# EAGLE schematic stm32_mather (EAGLE 9.6.2)
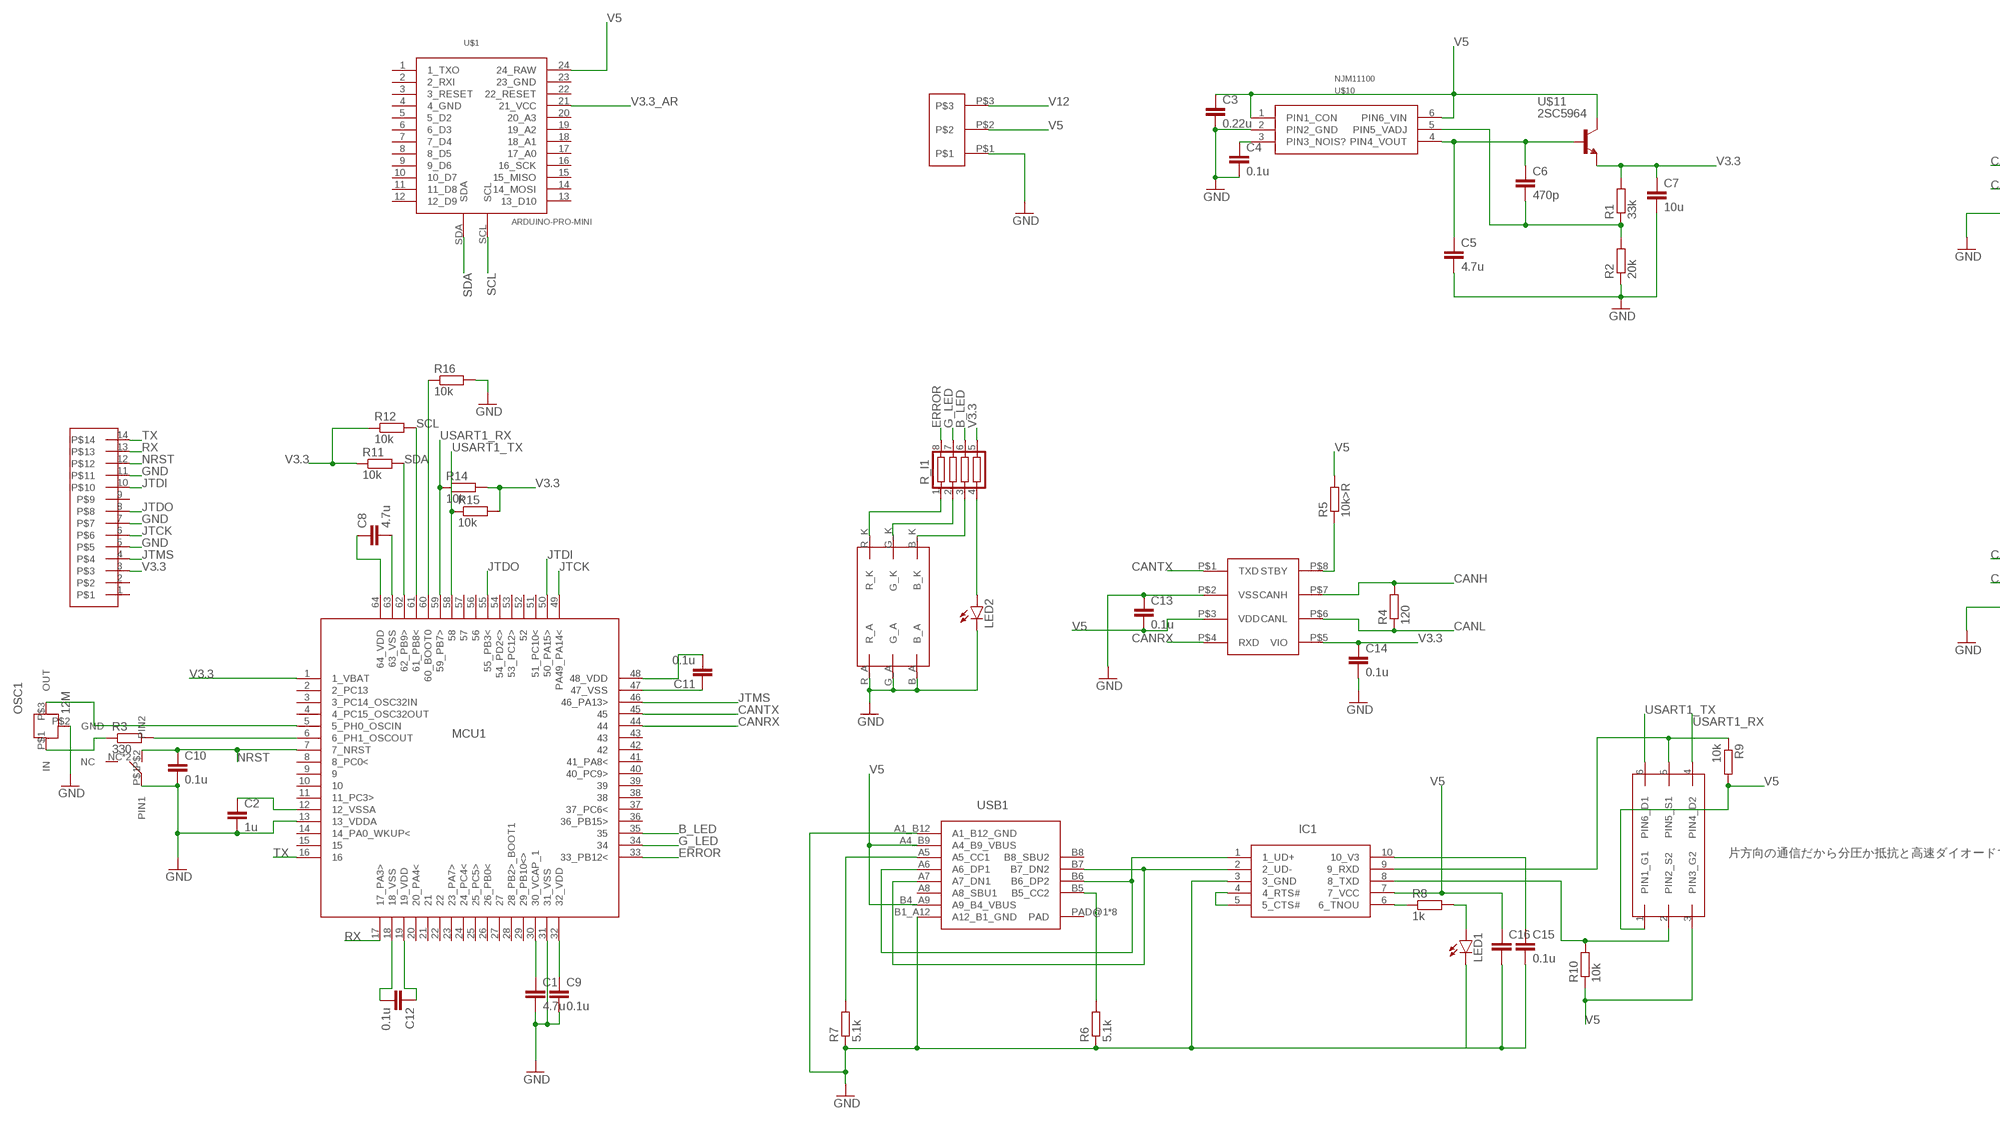
[diagram p0: schematic, sheet 1, part 1 of 2]
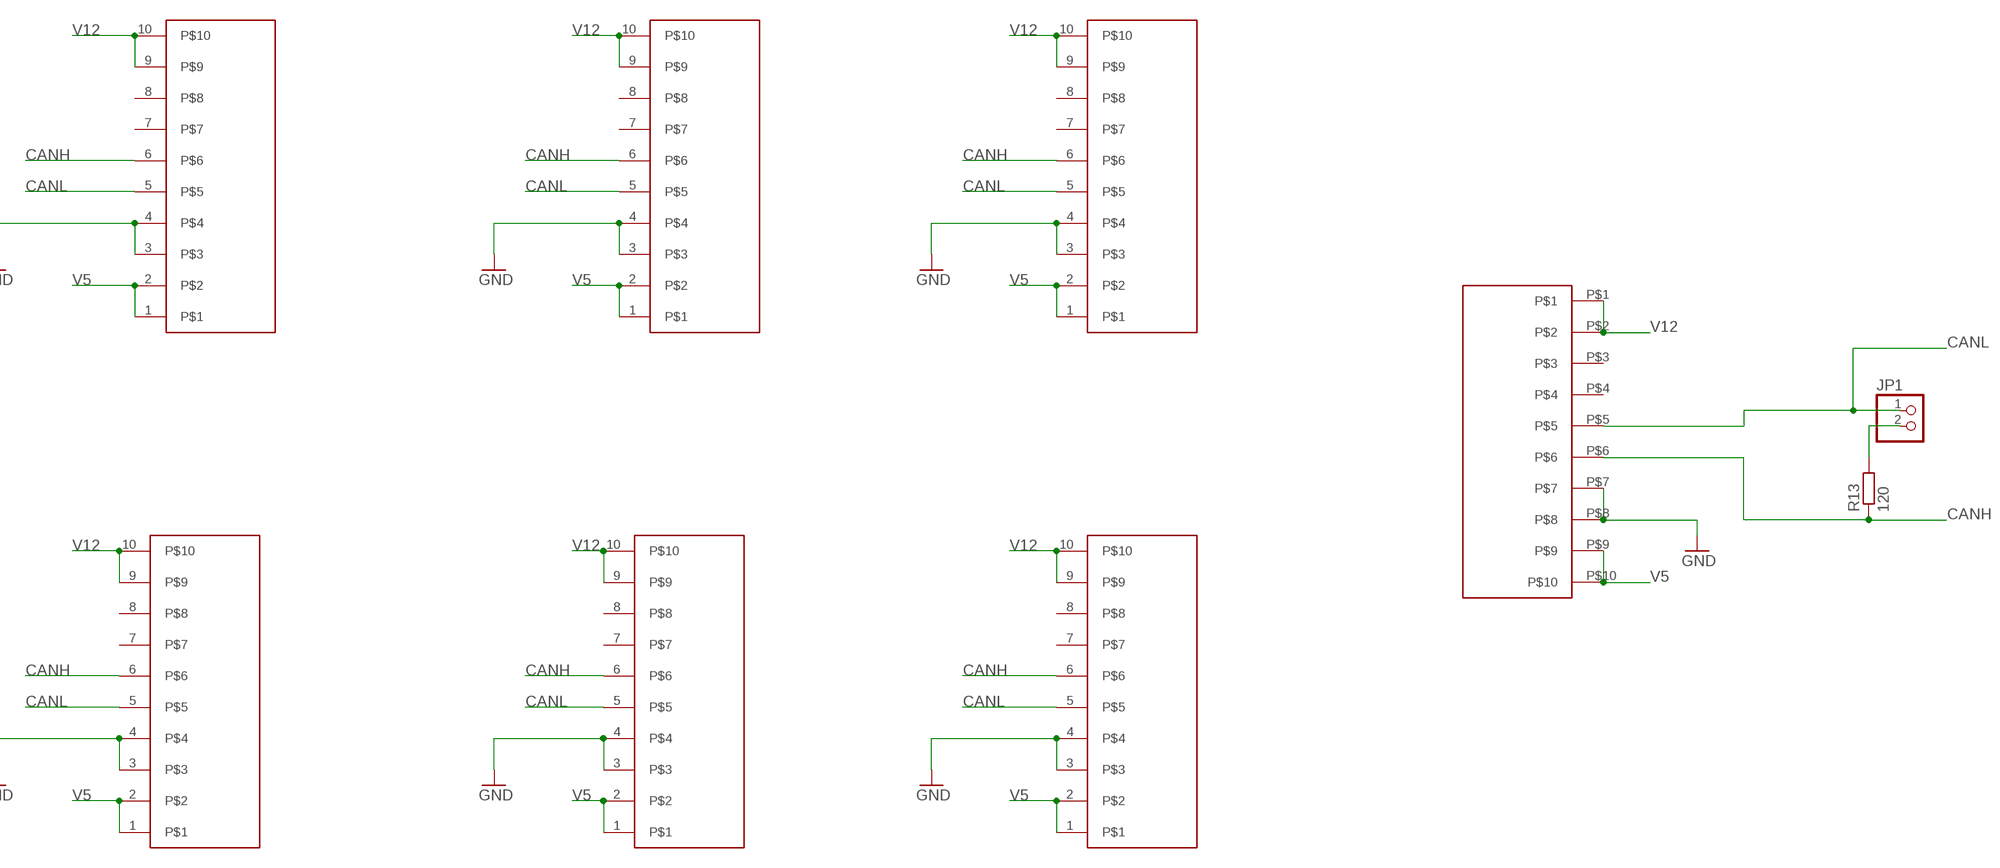
[diagram p1: schematic, sheet 1, part 2 of 2]

## Parts
C1  4.7u  C-EUC1608  [C1608]
C2  1u  C-EUC1608  [C1608]
C3  0.22u  C-EUC2012  [C2012]
C4  0.1u  C-EUC1608  [C1608]
C5  4.7u  C-EUC2012  [C2012]
C6  470p  C-EUC1608  [C1608]
C7  10u  C-EUC2012  [C2012]
C8  4.7u  C-EUC1608  [C1608]
C9  0.1u  C-EUC1608  [C1608]
C10  0.1u  C-EUC1608  [C1608]
C11  0.1u  C-EUC1608  [C1608]
C12  0.1u  C-EUC1608  [C1608]
C13  0.1u  C-EUC1608  [C1608]
C14  0.1u  C-EUC1608  [C1608]
C15  0.1u  C-EUC1608  [C1608]
C16  C-EUC1608  [C1608]
IC1  CH340E  [MSOP10]
JP1  PINHD-1X2  [1X02]
LED1  1608LED  [1608]
LED2  1608LED  [1608]
MCU1  STM32F446  [LQFP64-2]
OSC1  12M  CSTN#  [CSTNE#]
R1  33k  R_REG  [1608]
R2  20k  R_REG  [1608]
R3  330  R_REG  [1608]
R4  120  R_REG  [1608]
R5  10k>R  R_REG  [1608]
R6  5.1k  R_REG  [1608]
R7  5.1k  R_REG  [1608]
R8  1k  R_REG  [1608]
R9  10k  R_REG  [1608]
R10  10k  R_REG  [1608]
R11  10k  R_REG  [1608]
R12  10k  R_REG  [1608]
R13  120  R_REG  [1608]
R14  10k  R_REG  [1608]
R15  10k  R_REG  [1608]
R16  10k  R_REG  [1608]
R_I1  R_SHUGOU  [0603X4RESISTOR]
U$1  ARDUINO-PRO-MINI  [ARDUINO_PRO_MINI]
U$2  BOX10PBOX10PIN-MESU  [BOX10P-MESU]
U$3  BOX10PBOX10PIN-MESU  [BOX10P-MESU]
U$4  BOX10PBOX10PIN-MESU  [BOX10P-MESU]
U$5  BOX10PBOX10PIN-MESU  [BOX10P-MESU]
U$6  BOX10PBOX10PIN-MESU  [BOX10P-MESU]
U$7  BOX10PBOX10PIN-MESU  [BOX10P-MESU]
U$8  BOX10PBOX10P-L  [BOX10P-L]
U$9  YUROBLOCK3  [YUROBLOCK3]
U$10  NJM11100  [SOT23-6]
U$11  2SC5964  [PCP]
U$12  TAKUTOSUITTI2  [TAKUTOSUITTI2]
U$13  MCP2562MCP2561-SN  [SOIC8]
U$14  FDC6305  [SSOT6]
U$15  RGB_LED  [RGB_LED]
U$22  BOX14P  [CON_HEDA14P_1.27]
USB1  USB_TYPE_C  [USB_TYPE_C]

## Nets
B_LED: MCU1.35 R_I1.6
CANH: R4.2 R13.1 U$2.6 U$3.6 U$4.6 U$5.6 U$6.6 U$7.6 U$8.P$6 U$13.P$7(CANH)
CANL: JP1.1 R4.1 U$2.5 U$3.5 U$4.5 U$5.5 U$6.5 U$7.5 U$8.P$5 U$13.P$6(CANL)
CANRX: MCU1.44 U$13.P$4(RXD)
CANTX: MCU1.45 U$13.P$1(TXD)
ERROR: MCU1.33(33_PB12<) R_I1.8
G_LED: MCU1.34 R_I1.7
GND: C1.2 C3.2 C4.2 C5.2 C7.2 C9.2 C13.1 C14.2 C15.2 C16.2 IC1.3(3_GND) LED1.K LED2.K MCU1.31(31_VSS) OSC1.P$2(GND) R2.1 R6.1 R7.1 R16.2 U$2.3 U$2.4 U$3.3 U$3.4 U$4.3 U$4.4 U$5.3 U$5.4 U$6.3 U$6.4 U$7.3 U$7.4 U$8.P$7 U$8.P$8 U$9.P$1 U$10.2(PIN2_GND) U$13.P$2(VSS) U$15.B_A U$15.G_A U$15.R_A U$22.5 U$22.7 U$22.11 USB1.A1_B12(A1_B12_GND) USB1.B1_A12(A12_B1_GND)
JTCK: MCU1.49(PA49_PA14<) U$22.6
JTDI: MCU1.50(50_PA15>) U$22.10
JTDO: MCU1.55(55_PB3<) U$22.8
JTMS: MCU1.46(46_PA13>) U$22.4
N$1: C6.2 R1.1 R2.2 U$10.5(PIN5_VADJ)
N$2: C4.1 U$10.3(PIN3_NOIS?)
N$3: C5.1 C6.1 U$10.4(PIN4_VOUT) U$11.1(B)
N$4: C1.1 MCU1.30(30_VCAP_1)
N$5: C9.1 MCU1.32(32_VDD)
N$6: OSC1.P$1(IN) R3.1
N$7: C2.1 MCU1.12(12_VSSA)
N$8: C8.1 MCU1.64(64_VDD)
N$9: C8.2 MCU1.63(63_VSS)
N$10: R_I1.1 U$15.R_K
N$11: MCU1.5(5_PH0_OSCIN) OSC1.P$3(OUT)
N$12: MCU1.6(6_PH1_OSCOUT) R3.2
N$13: C12.2 MCU1.18(18_VSS)
N$14: C12.1 MCU1.19(19_VDD)
N$15: C11.1 MCU1.47(47_VSS)
N$16: C11.2 MCU1.48(48_VDD)
N$17: IC1.1(1_UD+) USB1.A6(A6_DP1) USB1.B6(B6_DP2)
N$18: IC1.2(2_UD-) USB1.A7(A7_DN1) USB1.B7(B7_DN2)
N$19: R5.1 U$13.P$8(STBY)
N$20: R7.2 USB1.A5(A5_CC1)
N$21: R6.2 USB1.B5(B5_CC2)
N$22: IC1.6(6_TNOU) R8.1
N$23: LED1.A R8.2
N$24: C15.1 IC1.10(10_V3)
N$25: IC1.4(4_RTS#) IC1.5(5_CTS#)
N$26: IC1.8(8_TXD) R10.2 U$14.2(PIN2_S2)
N$27: JP1.2 R13.2
N$28: IC1.9(9_RXD) R9.1 U$14.5(PIN5_S1)
N$29: R_I1.2 U$15.G_K
N$30: C2.2 C10.2 MCU1.13(13_VDDA) U$12.P$1(PIN1) ; supply symbol labelled GND
N$31: R_I1.3 U$15.B_K
N$32: LED2.A R_I1.4
N$33: MCU1.60(60_BOOT0) R16.1
NRST: C10.1 MCU1.7(7_NRST) U$12.P$2(PIN2) U$22.12
RX: MCU1.17(17_PA3>) U$22.13
SCL: MCU1.61(61_PB8<) R12.2 U$1.SCL
SDA: MCU1.62(62_PB9>) R11.2 U$1.SDA
TX: MCU1.16 U$22.14
USART1_RX: MCU1.59(59_PB7>) R14.1 U$14.4(PIN4_D2)
USART1_TX: MCU1.58 R15.1 U$14.6(PIN6_D1)
V3.3: C7.1 C14.1 MCU1.1(1_VBAT) R1.2 R11.1 R12.1 R14.2 R15.2 R_I1.5 U$11.3(E) U$13.P$5(VIO) U$22.3
V3.3_AR: U$1.21(21_VCC)
V5: C3.1 C13.2 C16.1 IC1.7(7_VCC) R5.2 R9.2 R10.1 U$1.24(24_RAW) U$2.1 U$2.2 U$3.1 U$3.2 U$4.1 U$4.2 U$5.1 U$5.2 U$6.1 U$6.2 U$7.1 U$7.2 U$8.P$9 U$8.P$10 U$9.P$2 U$10.1(PIN1_CON) U$10.6(PIN6_VIN) U$11.2(C) U$11.2@2(C) U$13.P$3(VDD) U$14.1(PIN1_G1) U$14.3(PIN3_G2) USB1.A4_B9(A4_B9_VBUS) USB1.B4_A9(A9_B4_VBUS)
V12: U$2.9 U$2.10 U$3.9 U$3.10 U$4.9 U$4.10 U$5.9 U$5.10 U$6.9 U$6.10 U$7.9 U$7.10 U$8.P$1 U$8.P$2 U$9.P$3
Unconnected: MCU1.2(2_PC13) MCU1.3(3_PC14_OSC32IN) MCU1.4(4_PC15_OSC32OUT) MCU1.8(8_PC0<) MCU1.9 MCU1.10 MCU1.11(11_PC3>) MCU1.14(14_PA0_WKUP<) MCU1.15 MCU1.20(20_PA4<) MCU1.21 MCU1.22 MCU1.23(23_PA7>) MCU1.24(24_PC4<) MCU1.25(25_PC5>) MCU1.26(26_PB0<) MCU1.27 MCU1.28(28_PB2>_BOOT1) MCU1.29(29_PB10<>) MCU1.36(36_PB15>) MCU1.37(37_PC6<) MCU1.38 MCU1.39 MCU1.40(40_PC9>) MCU1.41(41_PA8<) MCU1.42 MCU1.43 MCU1.51(51_PC10<) MCU1.52 MCU1.53(53_PC12>) MCU1.54(54_PD2<>) MCU1.56 MCU1.57 U$1.1(1_TXO) U$1.2(2_RXI) U$1.3(3_RESET) U$1.4(4_GND) U$1.5(5_D2) U$1.6(6_D3) U$1.7(7_D4) U$1.8(8_D5) U$1.9(9_D6) U$1.10(10_D7) U$1.11(11_D8) U$1.12(12_D9) U$1.13(13_D10) U$1.14(14_MOSI) U$1.15(15_MISO) U$1.16(16_SCK) U$1.17(17_A0) U$1.18(18_A1) U$1.19(19_A2) U$1.20(20_A3) U$1.22(22_RESET) U$1.23(23_GND) U$2.7 U$2.8 U$3.7 U$3.8 U$4.7 U$4.8 U$5.7 U$5.8 U$6.7 U$6.8 U$7.7 U$7.8 U$8.P$3 U$8.P$4 U$12.NC U$12.NC@2(NC) U$22.1 U$22.2 U$22.9 USB1.A8(A8_SBU1) USB1.B8(B8_SBU2) USB1.PAD@1(PAD) USB1.PAD@2(PAD) USB1.PAD@3(PAD) USB1.PAD@4(PAD) USB1.PAD@5(PAD) USB1.PAD@6(PAD) USB1.PAD@7(PAD) USB1.PAD@8(PAD)

## Notes on the sheet
- 片方向の通信だから分圧か抵抗と高速ダイオードでレベル変換するんでいい気がする

## Library data of the parts
C1-C16 = rcl:C-EU: CAPACITOR, European symbol; SPICEPREFIX: C
IC1 = user_ic:CH340E: USBシリアル変換IC CH340E 電源電圧：3.3V、5V usb伝送規格：usb2.0 クロック：12MHz 秋月電子通商通販コード[I-13543] 秋月のusbシリアル変換モジュールのtypeCのやつのICがこいつで回路図もでてた。中国語のデータシートか意味不明なので回路図でノリ
JP1 = pinhead:PINHD-1X2: PIN HEADER
LED1 LED2 = user_leds:1608LED: 1608LED
MCU1 = user_ic:STM32F446
OSC1 = user_osc:CSTN#: ムラタのセラロック （セラミック振動子） 周波数はいくつか種類あり(valueで設定して) 秋月電子通商のトップ/パーツ一般/発振子/セラミック発振子 uCからのoutが入るのがinであることに注意 https://akizukidenshi.com/catalog/c/cceralock/
R1-R16 = user_rcl:R_REG: 1608パッケージのチップ抵抗 ガッコのリールの抵抗はたぶんこれ
R_I1 = user_rcl:R_SHUGOU
U$1 = user_ic:ARDUINO-PRO-MINI: アルデュイーノプロミニ 上側の横向きの入るヘッダ用の穴は省略 多分基板に差し込むための穴ではなくてほかのシールドと連結するための穴であるから、フットプリント上に穴は必要ないと判断した。 なんか内側にあるi2cの信号の部分が糞of糞、組み込み設計者に喧嘩売ってるレベル
U$2-U$8 = user_conector:BOX10P
U$9 = user_conector:YUROBLOCK3
U$10 = user_ic:NJM11100: 可変型レギュレータ 秋月電子[I-06655]
U$11 = user_tr_fet_igbt:2SC5964: rs品番774-0746 PCP
U$12 = user_swich:TAKUTOSUITTI2: 表面実装タクトスイッチ 秋月電子通称通販コード[P-14888]
U$13 = user_ic:MCP2562
U$14 = user_tr_fet_igbt:FDC6305: デュアルNchMOSFET ゲート・ソース間絶対最大定格8v 秋月電子通商通販コード[I-06003]
U$15 = user_leds:RGB_LED: 秋月電子通商 I-12726
U$22 = user_conector:BOX14P
USB1 = user_conector:USB_TYPE_C: USBコネクタ type-C 秋月電子通商通販コード[C-14356]